# Altium schematic sheet DC Supply Input.SchDoc: Filter Test Board
size A4; SheetNumber: 1; SheetTotal: 1
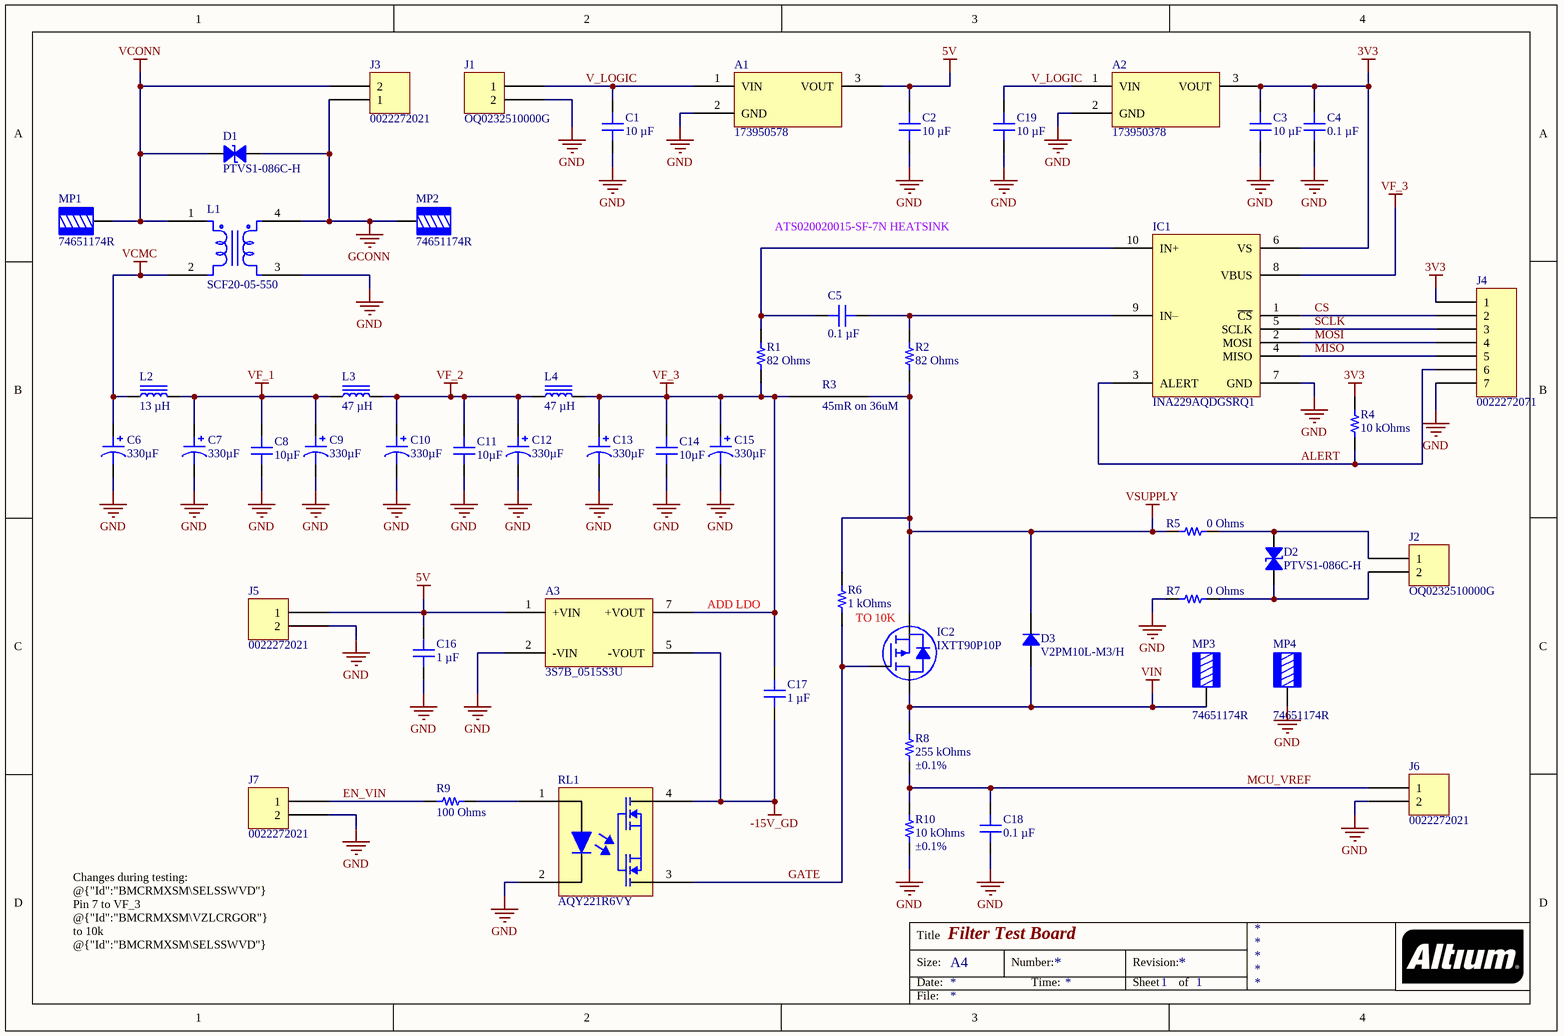
[diagram p0: DC Supply Input.SchDoc]

## Parts
A1  173950578  [WURTH WPME-FDSM SIP-3 173950x78]
A2  173950378  [WURTH WPME-FDSM SIP-3 173950x78]
A3  3S7B_0515S3U  [GAPTEC 3S7B_3U SINGLE]
C1  10 µF  [CAP 1206_3216 - 0.8MM]
C2  10 µF  [CAP 1206_3216 - 0.8MM]
C3  10 µF  [CAP 1206_3216 - 0.8MM]
C4  0.1 µF  [CAP 0603_1608]
C5  0.1 µF  [CAP 0603_1608]
C6  330µF  [CAP TH ALUM ELEC D18.00mm S7.50mm H26.50mm]
C7  330µF  [CAP TH ALUM ELEC D18.00mm S7.50mm H26.50mm]
C8  10µF  [CAP 2220_5650 2.5MM]
C9  330µF  [CAP TH ALUM ELEC D18.00mm S7.50mm H26.50mm]
C10  330µF  [CAP TH ALUM ELEC D18.00mm S7.50mm H26.50mm]
C11  10µF  [CAP 2220_5650 2.5MM]
C12  330µF  [CAP TH ALUM ELEC D18.00mm S7.50mm H26.50mm]
C13  330µF  [CAP TH ALUM ELEC D18.00mm S7.50mm H26.50mm]
C14  10µF  [CAP 2220_5650 2.5MM]
C15  330µF  [CAP TH ALUM ELEC D18.00mm S7.50mm H26.50mm]
C16  1 µF  [CAP 0603_1608]
C17  1 µF  [CAP 0603_1608]
C18  0.1 µF  [CAP 1812_4532 1.1MM]
C19  10 µF  [CAP 1206_3216 - 0.8MM]
D1  PTVS1-086C-H  [BOURNS PTSV-xxxC-H]
D2  PTVS1-086C-H  [BOURNS PTSV-xxxC-H]
D3  V2PM10L-M3/H  [VISHAY SMP DO-220AA]
IC1  INA229AQDGSRQ1  [TI VSSOP-10 DGS]
IC2  IXTT90P10P  [IXYS TO-268 P-CH GDS]
J1  OQ0232510000G  [FCI 06-381-2PIN]
J2  OQ0232510000G  [FCI 06-381-2PIN]
J3  0022272021  [MOLEX KK 0022272021]
J4  0022272071  [MOLEX KK 0022272071]
J5  0022272021  [MOLEX KK 0022272021]
J6  0022272021  [MOLEX KK 0022272021]
J7  0022272021  [MOLEX KK 0022272021]
L1  SCF20-05-550  [KEMET SCF20-05-550]
L2  13 µH  [WURTH WE-HCI 1365]
L3  47 µH  [WURTH WE-HCF 14.5MM]
L4  47 µH  [WURTH WE-HCF 14.5MM]
MP1  74651174R  [WURTH 74651174]
MP2  74651174R  [WURTH 74651174]
MP3  74651174R  [WURTH 74651174]
MP4  74651174R  [WURTH 74651174]
R1  82 Ohms  [RES 0603_1608]
R2  82 Ohms  [RES 0603_1608]
R3  45mR on 36uM  [PCB Shunt 0.3mm x 20mm - 45mOhm on 36uM]  (net tie, no BOM)
R4  10 kOhms  [RES 0603_1608]
R5  0 Ohms  [RES 0805_2012]
R6  1 kOhms  [RES 0805_2012]
R7  0 Ohms  [RES 0805_2012]
R8  Tolerance: ±0.1%  [RES 0603_1608]  (hidden comment: 255 kOhms)
R9  100 Ohms  [RES 0603_1608]
R10  Tolerance: ±0.1%  [RES 0603_1608]  (hidden comment: 10 kOhms)
RL1  AQY221R6VY  [PANASONIC CxR10_CxR5]

## Nets
3V3: A2.3(VOUT) C3.2 C4.2 IC1.6(VS) J4.1 R4.1
5V: A1.3(VOUT) A3.1(+VIN) C2.2 C16.2 J5.1
-15V_GD: A3.5(-VOUT) C17.1 RL1.4
GCONN: D1.2 J3.1 L1.4 MP2.1
GND: A1.2(GND) A2.2(GND) A3.2(-VIN) C1.1 C2.1 C3.1 C4.1 C6.2 C7.2 C8.1 C9.2 C10.2 C11.1 C12.2 C13.2 C14.1 C15.2 C16.1 C18.1 C19.1 IC1.7(GND) J1.2 J4.7 J5.2 J6.2 J7.2 L1.3 MP4.1 R7.2 R10.1 RL1.2
VCMC: C6.1 L1.2 L2.2
VCONN: D1.1 J3.2 L1.1 MP1.1
VF_1: C7.1 C8.2 C9.1 L2.1 L3.1
VF_2: C10.1 C11.2 C12.1 L3.2 L4.1
VF_3: A3.7(+VOUT) C13.1 C14.2 C15.1 C17.2 IC1.8(VBUS) L4.2 R1.1 R3.2
VIN: D3.2 IC2.D MP3.1 R8.1
VSUPPLY: D3.1 IC2.S R2.1 R3.1 R5.2 R6.2
ALERT: IC1.3(ALERT) J4.6 R4.2
CS: IC1.1(~{CS}) J4.2
EN_VIN: J7.1 R9.1
GATE: IC2.G R6.1 RL1.3
MCU_VREF: C18.2 J6.1 R8.2 R10.2
MISO: IC1.4(MISO) J4.5
MOSI: IC1.2(MOSI) J4.4
SCLK: IC1.5(SCLK) J4.3
V_LOGIC: A1.1(VIN) A2.1(VIN) C1.2 C19.2 J1.1
NetC5_1: C5.1 IC1.9(IN–) R2.2
NetC5_2: C5.2 IC1.10(IN+) R1.2
NetD2_1: D2.1 J2.1 R5.1
NetD2_2: D2.2 J2.2 R7.1
NetR9_2: R9.2 RL1.1

## Notes on the sheet
- ATS020020015-SF-7N HEATSINK
- ADD LDO
- TO 10K
- Changes during testing:
  @{"Id":"BMCRMXSM\SELSSWVD"} Pin 7 to VF_3
  @{"Id":"BMCRMXSM\VZLCRGOR"} to 10k
  @{"Id":"BMCRMXSM\SELSSWVD"} needs LDO between it and relay
- Title
- Size:
- Date:
- A4
- Number:
- Time:
- Revision:
- Sheet
- of
- File:

## Library data of the parts
A1 = 173950578: DC DC CONVERTER 5V 2.5W; Manufacturer: Würth Elektronik; Current - Output (Max): 500mA; Efficiency: 95%; Number of Outputs: 1; Voltage - Input (Max): 28V; Voltage - Input (Min): 6V; Part Number: 173950578; Applications: ITE (Commercial); ComponentLink1Description: Datasheet; ComponentLink1URL: //media.digikey.com/pdf/Data%20Sheets/Wurth%20Electronics%20PDFs/173950378_173950578.pdf; ComponentLink2Description: DigiKey Link; ComponentLink2URL: https://www.digikey.com/en/products/detail/würth-elektronik/173950578/5725367; Features: OTP, OVP, SCP; LastUpdated: 10/08/2022 09:48:51; Lifecycle Status: Active; Minimum Order: 1; Mounting Type: Through Hole; Operating Temperature: -40°C ~ 85°C; Package / Case: 3-SIP Module; Packaging: Tube; PartId: 51; Part Status: Active; Power (Watts): 2.5 W; Price: 4.40; Series: MagI³C (1W); Size / Dimension: 0.46" L x 0.33" W x 0.41" H (11.6mm x 8.5mm x 10.4mm); Supplier 1: DigiKey; Supplier Part Number 1: 732-8243-5-ND; Type: Linear Regulator Replacement; Voltage - Output 1: 5V
A2 = 173950378: DC DC CONVERTER 3.3V 1.65W; Manufacturer: Würth Elektronik; Current - Output (Max): 500mA; Efficiency: 95%; Number of Outputs: 1; Voltage - Input (Max): 28V; Voltage - Input (Min): 6V; Part Number: 173950378; Applications: ITE (Commercial); ComponentLink1Description: Datasheet; ComponentLink1URL: //media.digikey.com/pdf/Data%20Sheets/Wurth%20Electronics%20PDFs/173950378_173950578.pdf; ComponentLink2Description: DigiKey Link; ComponentLink2URL: https://www.digikey.com/en/products/detail/würth-elektronik/173950378/5725366; Features: OTP, OVP, SCP; LastUpdated: 10/08/2022 09:47:10; Lifecycle Status: Active; Minimum Order: 1; Mounting Type: Through Hole; Operating Temperature: -40°C ~ 85°C; Package / Case: 3-SIP Module; Packaging: Tube; PartId: 50; Part Status: Active; Power (Watts): 1.65 W; Price: 4.40; Series: MagI³C (1W); Size / Dimension: 0.46" L x 0.33" W x 0.41" H (11.6mm x 8.5mm x 10.4mm); Supplier 1: DigiKey; Supplier Part Number 1: 732-8242-5-ND; Type: Linear Regulator Replacement; Voltage - Output 1: 3.3V
A3 = 3S7B_0515S3U: DC-DC; Manufacturer: GAPTEC Electronic; Current - Output (Max): 200mA; Efficiency: 84%; Number of Outputs: 1; Power (Watts): 3 W; Voltage - Input (Max): 5.5V; Voltage - Input (Min): 4.5V; Voltage - Isolation: 3 kV; Voltage - Output 1: 15V; Part Number: 3S7B_0515S3U; Applications: ITE (Commercial); ComponentLink1Description: Datasheet; ComponentLink1URL: https://gaptec-electronic.com/datenblaetter/3S7B_3U.pdf; ComponentLink2Description: DigiKey Link; ComponentLink2URL: https://www.digikey.com/en/products/detail/gaptec-electronic/3S7B-0515S3U/13692172; LastUpdated: 20/08/2023 04:04:06; Lifecycle Status: Active; Minimum Order: 1; Mounting Type: Through Hole; Operating Temperature: -40°C ~ 85°C; Packaging: Tube; PartId: 69; Part Status: Active; Price: 5.05; Series: 3S7B_3U (3W); Size / Dimension: 0.77" L x 0.28" W x 0.39" H (19.6mm x 7.0mm x 10.0mm); Supplier 1: DigiKey; Supplier Part Number 1: 3182-3S7B_0515S3U-ND; Type: Isolated Module
C1-C3 C19 = CL31B106KAHNNNE: CAP CER 10UF 25V X7R 1206; manufacturer: Samsung Electro-Mechanics; Tolerance: ±10%; Part Number: CL31B106KAHNNNE; Value: 10 µF; Applications: General Purpose; Capacitance: 10 µF; componentlink1description: Datasheet; componentlink1url: http://www.samsungsem.com/kr/support/product-search/mlcc/CL31B106KAHNNNE.jsp; componentlink2description: DigiKey Link; componentlink2url: https://www.digikey.com/en/products/detail/samsung-electro-mechanics/CL31B106KAHNNNE/3887462; Device Package: 1206 (3216 Metric); lastupdated: 12/09/2023 19:14:51; Lifecycle Status: Active; Minimum Order: 1; Mounting Type: Surface Mount, MLCC; Operating Temperature: -55°C ~ 125°C; Package / Case: 1206 (3216 Metric); packaging: TapeAndReel; partid: 40754; Part Status: Active; price: 0.03; series: CL; Size / Dimension: 0.126" L x 0.063" W (3.20mm x 1.60mm); Supplier 1: DigiKey; Supplier Part Number 1: 1276-1804-1-ND; Temperature Coefficient: X7R; Thickness (Max): 0.071" (1.80mm); Voltage - Rated: 25V
C4 C5 = CL10B104KB8NNNC: CAP CER 0.1UF 50V X7R 0603; manufacturer: Samsung Electro-Mechanics; Tolerance: ±10%; Part Number: CL10B104KB8NNNC; Value: 0.1 µF; Applications: General Purpose; Capacitance: 0.1 µF; componentlink1description: Datasheet; componentlink1url: http://www.samsungsem.com/kr/support/product-search/mlcc/CL10B104KB8NNNC.jsp; componentlink2description: DigiKey Link; componentlink2url: https://www.digikey.com/en/products/detail/samsung-electro-mechanics/CL10B104KB8NNNC/3886658; Device Package: 0603 (1608 Metric); lastupdated: 20/08/2023 19:09:00; Lifecycle Status: Active; Minimum Order: 1; Mounting Type: Surface Mount, MLCC; Operating Temperature: -55°C ~ 125°C; Package / Case: 0603 (1608 Metric); packaging: TapeAndReel; partid: 9788; Part Status: Active; price: 0.01; series: CL; Size / Dimension: 0.063" L x 0.031" W (1.60mm x 0.80mm); Supplier 1: DigiKey; Supplier Part Number 1: 1276-1000-1-ND; Temperature Coefficient: X7R; Thickness (Max): 0.035" (0.90mm); Voltage - Rated: 50V
C6 C7 C9 C10 C12 C13 C15 = UCY2C331MHD6TN: CAP ALUM 330UF 20% 160V RADIAL; manufacturer: Nichicon; Lifetime @ Temp.: 12000 Hrs @ 105°C; Polarization: Polar; Ripple Current @ High Frequency: 2.89A @ 100kHz; Ripple Current @ Low Frequency: 1.445A @ 120Hz; Part Number: UCY2C331MHD6TN; Applications: General Purpose; Capacitance: 330µF; componentlink1description: Datasheet; componentlink1url: http://nichicon-us.com/english/products/pdfs/e-ucy.pdf; componentlink2description: DigiKey Link; componentlink2url: http://digikey.com/product-detail/en/nichicon/UCY2C331MHD6TN/493-4791-1-ND/3129128; Device Package: Radial, Can; Height - Seated (Max): 1.043" (26.50mm); lastupdated: 02/09/2020 01:33:18; Lead Spacing: 0.295" (7.50mm); Lifecycle Status: Active; Minimum Order: 1; Mounting Type: Through Hole; Operating Temperature: -40°C ~ 105°C; Package / Case: Radial, Can; packaging: TapeAndBox; partid: 18242; Part Status: Active; price: 1.37; series: UCY; Size / Dimension: 0.709" Dia (18.00mm); Supplier 1: DigiKey; Supplier Part Number 1: 493-4791-1-ND; Tolerance: ±20%; value: 330µF; Voltage - Rated: 160V
C8 C11 C14 = CGA9N3X7S2A106M230KB: CAP CER 10UF 100V X7S 2220; manufacturer: TDK Corporation; Tolerance: ±20%; Part Number: CGA9N3X7S2A106M230KB; Value: 10µF; Applications: Automotive; Capacitance: 10µF; componentlink1description: Datasheet; componentlink1url: https://product.tdk.com/info/en/catalog/datasheets/mlcc_automotive_midvoltage_en.pdf?ref_disty=digikey; componentlink2description: DigiKey Link; componentlink2url: http://digikey.com/product-detail/en/tdk-corporation/CGA9N3X7S2A106M230KB/445-13152-1-ND/3954818; Device Package: 2220 (5750 Metric); lastupdated: 02/09/2020 01:11:20; Lifecycle Status: Active; Minimum Order: 1; Mounting Type: Surface Mount, MLCC; Operating Temperature: -55°C ~ 125°C; Package / Case: 2220 (5750 Metric); packaging: TapeAndReel; Part Status: Active; price: 1.11; Ratings: AEC-Q200; series: CGA; Size / Dimension: 0.224" L x 0.197" W (5.70mm x 5.00mm); Supplier 1: DigiKey; Supplier Part Number 1: 445-13152-1-ND; Temperature Coefficient: X7S; Thickness (Max): 0.098" (2.50mm); Voltage - Rated: 100V
C16 C17 = GCM188R71E105KA64D: CAP CER 1UF 25V X7R 0603; manufacturer: Murata Electronics; Tolerance: ±10%; Part Number: GCM188R71E105KA64D; Value: 1 µF; Applications: Automotive; Capacitance: 1 µF; componentlink1description: Datasheet; componentlink1url: https://www.murata.com/~/media/webrenewal/support/library/catalog/products/capacitor/mlcc/c03e.ashx?la=en-us; componentlink2description: DigiKey Link; componentlink2url: https://www.digikey.com/en/products/detail/murata-electronics/GCM188R71E105KA64D/4903956; Device Package: 0603 (1608 Metric); lastupdated: 20/08/2023 19:09:04; Lifecycle Status: Active; Minimum Order: 1; Mounting Type: Surface Mount, MLCC; Operating Temperature: -55°C ~ 125°C; Package / Case: 0603 (1608 Metric); packaging: TapeAndReel; partid: 6762; Part Status: Active; price: 0.03; Ratings: AEC-Q200; series: GCM; Size / Dimension: 0.063" L x 0.031" W (1.60mm x 0.80mm); Supplier 1: DigiKey; Supplier Part Number 1: 490-10673-1-ND; Temperature Coefficient: X7R; Thickness (Max): 0.035" (0.90mm); Voltage - Rated: 25V
C18 = C1812C104J2GACAUTO: CAP CER 0.1UF 200V C0G/NP0 1812; manufacturer: KEMET; Temperature Coefficient: C0G, NP0; Tolerance: ±5%; Part Number: C1812C104J2GACAUTO; Value: 0.1 µF; Applications: Automotive; Capacitance: 0.1 µF; componentlink1description: Datasheet; componentlink1url: https://api.kemet.com/component-edge/download/datasheet/C1812C104J2GACAUTO.pdf; componentlink2description: DigiKey Link; componentlink2url: https://www.digikey.com/en/products/detail/kemet/C1812C104J2GACAUTO/4860166; Device Package: 1812 (4532 Metric); Features: Low ESL; lastupdated: 16/08/2023 19:37:06; Lifecycle Status: Active; Minimum Order: 1; Mounting Type: Surface Mount, MLCC; Operating Temperature: -55°C ~ 125°C; Package / Case: 1812 (4532 Metric); packaging: TapeAndReel; Part Status: Active; price: 0.57; Ratings: AEC-Q200; series: SMD Auto C0G; Size / Dimension: 0.177" L x 0.126" W (4.50mm x 3.20mm); Supplier 1: DigiKey; Supplier Part Number 1: 399-11585-1-ND; Thickness (Max): 0.087" (2.20mm); Voltage - Rated: 200V
D1 D2 = PTVS1-086C-H: TVS DIODE 86VWM 99VC 2DFN; Manufacturer: Bourns Inc.; Bidirectional Channels: 1; Current - Peak Pulse (10/1000µs): 1000A (1kA) (8/20µs); Power Line Protection: No; Type: Zener; Voltage - Breakdown (Min): 96V; Voltage - Clamping (Max) @ Ipp: 99V (Typ); Voltage - Reverse Standoff (Typ): 86V; Part Number: PTVS1-086C-H; Applications: General Purpose; ComponentLink1Description: Datasheet; ComponentLink1URL: https://www.digikey.com http://www.bourns.com/docs/Product-Datasheets/PTVS1-xxxC-H.pdf; ComponentLink2Description: DigiKey Link; ComponentLink2URL: https://www.digikey.com/en/products/detail/bourns-inc/PTVS1-086C-H/16642576; LastUpdated: 20/08/2023 21:00:35; Lifecycle Status: Active; Minimum Order: 1; Mounting Type: Surface Mount; Operating Temperature: -55°C ~ 125°C (TA); Packaging: TapeAndReel; PartId: 11756; Part Status: Active; Price: 2.82; Series: PTVS; Supplier 1: DigiKey; Supplier Part Number 1: 118-PTVS1-086C-HCT-ND; Supplier Device Package: 2-DFN (8x6)
D3 = V2PM10L-M3/H: DIODE SCHOTTKY 100V 1.9A DO220AA; Manufacturer: Vishay General Semiconductor - Diodes Division; Capacitance @ Vr, F: 195pF @ 4V, 1MHz; Current - Reverse Leakage @ Vr: 100 µA @ 100 V; Speed: Fast Recovery =< 500ns, > 200mA (Io); Voltage - Forward (Vf) (Max) @ If: 550 mV @ 1 A; Part Number: V2PM10L-M3/H; ComponentLink1Description: Datasheet; ComponentLink1URL: https://www.vishay.com/docs/87463/v2pm10l.pdf; ComponentLink2Description: DigiKey Link; ComponentLink2URL: https://www.digikey.com/en/products/detail/vishay-general-semiconductor-diodes-division/V2PM10L-M3-H/10638928; Current - Average Rectified (Io): 1.9A; Diode Type: Schottky; LastUpdated: 19/08/2023 20:45:06; Lifecycle Status: Active; Minimum Order: 1; Mounting Type: Surface Mount; Operating Temperature - Junction: -40°C ~ 175°C; Packaging: TapeAndReel; PartId: 3477; Part Status: Active; Price: 0.06; Series: eSMP®, TMBS®; Supplier 1: DigiKey; Supplier Part Number 1: 112-V2PM10L-M3/HCT-ND; Supplier Device Package: DO-220AA (SMP); Voltage - DC Reverse (Vr) (Max): 100 V
IC1 = INA229AQDGSRQ1: IC OPAMP GP 1 CIRCUIT 10VSSOP; Manufacturer: Texas Instruments; Amplifier Type: General Purpose; Current - Input Bias: 100 pA; Current - Supply: 640µA; Number of Circuits: 1; Output Type: Open Drain; Voltage - Input Offset: 0.3 µV; Part Number: INA229AQDGSRQ1; ComponentLink2Description: DigiKey Link; ComponentLink2URL: https://www.digikey.com/en/products/detail/texas-instruments/INA229AQDGSRQ1/14641455; LastUpdated: 20/08/2023 19:45:13; Lifecycle Status: Active; Minimum Order: 1; Mounting Type: Surface Mount; Operating Temperature: -40°C ~ 125°C (TA); Packaging: TapeAndReel; PartId: 53; Part Status: Active; Price: 3.66; Series: Automotive, AEC-Q100; Supplier 1: DigiKey; Supplier Part Number 1: 296-INA229AQDGSRQ1CT-ND; Supplier Device Package: 10-VSSOP
IC2 = IXTT90P10P: MOSFET P-CH 100V 90A TO268; Manufacturer: IXYS; Current - Continuous Drain (Id) @ 25°C: 90A (Tc); Drive Voltage (Max Rds On,  Min Rds On): 10V; FET Type: P-Channel; Gate Charge (Qg) (Max) @ Vgs: 120 nC @ 10 V; Input Capacitance (Ciss) (Max) @ Vds: 5800 pF @ 25 V; Power Dissipation (Max): 462W (Tc); Rds On (Max) @ Id, Vgs: 25mOhm @ 45A, 10V; Vgs (Max): ±20V; Vgs(th) (Max) @ Id: 4V @ 250µA; Part Number: IXTT90P10P; ComponentLink1Description: Datasheet; ComponentLink1URL: http://ixapps.ixys.com/DataSheet/DS99986B(IXTH-T90P10P).pdf; ComponentLink2Description: DigiKey Link; ComponentLink2URL: https://www.digikey.com/en/products/detail/ixys/IXTT90P10P/1995431; Drain to Source Voltage (Vdss): 100 V; LastUpdated: 17/08/2023 02:38:22; Lifecycle Status: Active; Minimum Order: 1; Mounting Type: Surface Mount; Operating Temperature: -55°C ~ 150°C (TJ); Package / Case: TO-268-3, D³Pak (2 Leads + Tab), TO-268AA; Packaging: Tube; Part Status: Active; Price: 8.00; Series: PolarP™; Supplier 1: DigiKey; Supplier Part Number 1: IXTT90P10P-ND; Supplier Device Package: TO-268AA; Technology: MOSFET (Metal Oxide)
J1 J2 = OQ0232510000G: TERM BLOCK HDR 2POS 90DEG 3.81MM; Manufacturer: Amphenol Anytek; Current - UL: 10A; Header Orientation: 90°, Right Angle; Number of Levels: 1; Number of Positions: 2; Pitch: 0.150" (3.81mm); Voltage - UL: 300V; Part Number: OQ0232510000G; Color: Green; ComponentLink1Description: Datasheet; ComponentLink1URL: http://portal.fciconnect.com/Comergent//fci/drawing/oqxx32x100j0g.pdf; ComponentLink2Description: DigiKey Link; ComponentLink2URL: //digikey.com/product-detail/en/amphenol-anytek/OQ0232510000G/609-3819-ND/2261255; Contact Mating Finish: Tin; LastUpdated: 16/12/2019 19:14:30; Lifecycle Status: 0; Minimum Order: 1; Mounting Type: Through Hole; Operating Temperature: -40°C ~ 115°C; Packaging: Bulk; Part Status: Active; Positions Per Level: 2; Price: 0.49; Series: 06-381; Supplier 1: DigiKey; Supplier Part Number 1: 609-3819-ND; Termination Style: Solder; Type: Header, Male Pins, Shrouded (4 Side)
J3 J5-J7 = 0022272021: CONN HEADER VERT 2POS 2.54MM; Manufacturer: Molex; Contact Length - Mating: 0.295" (7.49mm); Contact Length - Post: 0.140" (3.56mm); Material Flammability Rating: UL94 V-0; Number of Positions: 2; Number of Positions Loaded: All; Overall Contact Length: 0.560" (14.22mm); Pitch - Mating: 0.100" (2.54mm); Shrouding: Shrouded - 1 Wall; Style: Board to Cable/Wire; Part Number: 0022272021; ComponentLink1Description: Datasheet; ComponentLink1URL: https://www.molex.com/pdm_docs/sd/022272021_sd.pdf; ComponentLink2Description: DigiKey Link; ComponentLink2URL: http://digikey.com/product-detail/en/molex/0022272021/WM4111-ND/1130577; Connector Type: Header; Contact Finish - Mating: Tin; Contact Finish - Post: Tin; Contact Finish Thickness - Mating: 100.0µin (2.54µm); Contact Material: Brass; Contact Shape: Square; Contact Type: Male Pin; Fastening Type: Friction Lock; Insulation Color: Natural; Insulation Height: 0.461" (11.70mm); Insulation Material: Polyamide (PA), Nylon; LastUpdated: 12/01/2020 23:51:43; Lifecycle Status: Active; Minimum Order: 1; Mounting Type: Through Hole; Number of Rows: 1; Packaging: Bulk; PartId: 76; Part Status: Active; Price: 0.27; Series: KK 6410; Supplier 1: DigiKey; Supplier Part Number 1: WM4111-ND; Termination: Solder
J4 = 0022272071: CONN HEADER VERT 7POS 2.54MM; Manufacturer: Molex; Contact Length - Mating: 0.295" (7.49mm); Contact Length - Post: 0.140" (3.56mm); Material Flammability Rating: UL94 V-0; Number of Positions: 7; Number of Positions Loaded: All; Overall Contact Length: 0.560" (14.22mm); Pitch - Mating: 0.100" (2.54mm); Shrouding: Shrouded - 1 Wall; Style: Board to Cable/Wire; Part Number: 0022272071; ComponentLink1Description: Datasheet; ComponentLink1URL: https://www.molex.com/pdm_docs/sd/022272071_sd.pdf; ComponentLink2Description: DigiKey Link; ComponentLink2URL: http://digikey.com/product-detail/en/molex/0022272071/WM4116-ND/1130582; Connector Type: Header; Contact Finish - Mating: Tin; Contact Finish - Post: Tin; Contact Finish Thickness - Mating: 100.0µin (2.54µm); Contact Material: Brass; Contact Shape: Square; Contact Type: Male Pin; Fastening Type: Friction Lock; Insulation Color: Natural; Insulation Height: 0.461" (11.70mm); Insulation Material: Polyamide (PA), Nylon; LastUpdated: 12/01/2020 23:52:32; Lifecycle Status: Active; Minimum Order: 1; Mounting Type: Through Hole; Number of Rows: 1; Packaging: Bulk; PartId: 81; Part Status: Active; Price: 0.56; Series: KK 6410; Supplier 1: DigiKey; Supplier Part Number 1: WM4116-ND; Termination: Solder
L1 = SCF20-05-550: CMC 5.5MH 5A 2LN TH; Manufacturer: KEMET; DC Resistance (DCR) (Max): 28mOhm; Filter Type: Power Line; Inductance @ Frequency: 5.5mH @ 10kHz; Number of Lines: 2; Voltage Rating - AC: 250V; Part Number: SCF20-05-550; ComponentLink1Description: Datasheet; ComponentLink1URL: https://api.kemet.com/component-edge/download/datasheet/SCF20-05-550.pdf; ComponentLink2Description: DigiKey Link; ComponentLink2URL: http://digikey.com/product-detail/en/kemet/SCF20-05-550/399-10780-ND/4290846; Current Rating (Max): 5A; Height (Max): 0.984" (25.00mm); LastUpdated: 19/08/2023 04:18:52; Lifecycle Status: Active; Minimum Order: 1; Mounting Type: Through Hole; Operating Temperature: -25°C ~ 120°C; Package / Case: Vertical, No Base, 4 PC Pin; Packaging: Bulk; Part Status: Active; Price: 7.23; Series: SC; Size / Dimension: 0.984" L x 0.610" W (25.00mm x 15.50mm); Supplier 1: DigiKey; Supplier Part Number 1: 399-10780-ND; Voltage Rating - DC: 250V
L2 = 7443551131: FIXED IND 13UH 10A 11.2 MOHM SMD; Manufacturer: Würth Elektronik; Current - Saturation: 9A; Frequency - Self Resonant: 14MHz; Inductance Frequency - Test: 100 kHz; Material - Core: Nonstandard; Shielding: Shielded; Tolerance: ±20%; Type: Wirewound; Part Number: 7443551131; ComponentLink1Description: Datasheet; ComponentLink1URL: https://katalog.we-online.de/pbs/datasheet/7443551131.pdf; ComponentLink2Description: DigiKey Link; ComponentLink2URL: https://www.digikey.com/en/products/detail/würth-elektronik/7443551131/1638545; Current Rating (Amps): 10 A; DC Resistance (DCR): 11.2mOhm; Device Package: Nonstandard; Height - Seated (Max): 0.256" (6.50mm); Inductance: 13 µH; LastUpdated: 18/08/2023 20:44:44; Lifecycle Status: Active; Minimum Order: 1; Mounting Type: Surface Mount; Operating Temperature: -40°C ~ 155°C; Package / Case: Nonstandard; Packaging: TapeAndReel; PartId: 5628; Part Status: Active; Price: 2.50; Ratings: AEC-Q200; Series: WE-HCI; Size / Dimension: 0.512" L x 0.504" W (13.00mm x 12.80mm); Supplier 1: DigiKey; Supplier Part Number 1: 732-1140-1-ND; Supplier Device Package: 1365; Value: 13 µH
L3 L4 = 7443634700: FIXED IND 47UH 12A 12.2 MOHM SMD; Manufacturer: Würth Elektronik; Current - Saturation: 8.5A; Frequency - Self Resonant: 10MHz; Inductance Frequency - Test: 100 kHz; Material - Core: Manganese Zinc Ferrite (MnZn); Shielding: Shielded; Tolerance: ±15%; Type: Drum Core, Wirewound; Part Number: 7443634700; ComponentLink1Description: Datasheet; ComponentLink1URL: https://katalog.we-online.de/pbs/datasheet/7443634700.pdf; ComponentLink2Description: DigiKey Link; ComponentLink2URL: https://www.digikey.com/en/products/detail/würth-elektronik/7443634700/2440342; Current Rating (Amps): 12 A; DC Resistance (DCR): 12.2mOhm; Device Package: Nonstandard; Height - Seated (Max): 0.571" (14.50mm); Inductance: 47 µH; LastUpdated: 18/08/2023 20:35:26; Lifecycle Status: Active; Minimum Order: 1; Mounting Type: Surface Mount; Operating Temperature: -40°C ~ 125°C; Package / Case: Nonstandard; Packaging: TapeAndReel; PartId: 3230; Part Status: Active; Price: 4.84; Ratings: AEC-Q200; Series: WE-HCF; Size / Dimension: 0.858" L x 0.846" W (21.80mm x 21.50mm); Supplier 1: DigiKey; Supplier Part Number 1: 732-2525-1-ND; Value: 47 µH
MP1-MP4 = 74651174R: TERM REDCUBE 4PIN PCB; Manufacturer: Würth Elektronik; Current Rating (Amps): 50 A; Part Number: 74651174R; ComponentLink1Description: Datasheet; ComponentLink1URL: https://katalog.we-online.de/em/datasheet/74651174R.pdf; ComponentLink2Description: DigiKey Link; ComponentLink2URL: https://www.digikey.com/en/products/detail/würth-elektronik/74651174R/6644001; LastUpdated: 07/08/2022 21:19:28; Lifecycle Status: Active; Minimum Order: 1; Mounting Type: Through Hole; Number of Pins: 4; Packaging: TapeAndReel; Part Status: Active; Price: 2.06; Series: REDCUBE WP-THRSH; Supplier 1: DigiKey; Supplier Part Number 1: 732-10905-1-ND; Terminal Type: Shank Terminal; Termination: Solder
R1 R2 = RC0603FR-0782RL: RES 82 OHM 1% 1/10W 0603; Manufacturer: Yageo; Power (Watts): 0.1W, 1/10W; Temperature Coefficient: ±100ppm/°C; Part Number: RC0603FR-0782RL; Value: 82 Ohms; ComponentLink1Description: Datasheet; ComponentLink1URL: https://www.yageo.com/upload/media/product/productsearch/datasheet/rchip/PYu-RC_Group_51_RoHS_L_10.pdf; ComponentLink2Description: DigiKey Link; ComponentLink2URL: https://www.digikey.com/en/products/detail/yageo/RC0603FR-0782RL/727399; Composition: Thick Film; Device Package: 0603 (1608 Metric); Features: Moisture Resistant; Height - Seated (Max): 0.022" (0.55mm); LastUpdated: 20/08/2023 19:34:58; Lifecycle Status: Active; Minimum Order: 1; Number of Terminations: 2; Operating Temperature: -55°C ~ 155°C; Package / Case: 0603 (1608 Metric); Packaging: CutTape; PartId: 19108; Part Status: Active; Price: 0.01; Resistance: 82 Ohms; Series: RC_L; Size / Dimension: 0.063" L x 0.031" W (1.60mm x 0.80mm); Supplier 1: DigiKey; Supplier Part Number 1: 311-82.0HRCT-ND; Supplier Device Package: 0603; Tolerance: ±1%
R3 = Current Shunt 45mR on 36uM
R4 R10 = ERJ-PB3B1002V: RES SMD 10K OHM 0.1% 1/5W 0603; Manufacturer: Panasonic Electronic Components; Power (Watts): 0.2W, 1/5W; Temperature Coefficient: ±50ppm/°C; Part Number: ERJ-PB3B1002V; Value: 10 kOhms; ComponentLink1Description: Datasheet; ComponentLink1URL: https://industrial.panasonic.com/cdbs/www-data/pdf/RDM0000/AOA0000C328.pdf; ComponentLink2Description: DigiKey Link; ComponentLink2URL: https://www.digikey.com/en/products/detail/panasonic-electronic-components/ERJ-PB3B1002V/6212869; Composition: Thick Film; Device Package: 0603 (1608 Metric); Features: Automotive AEC-Q200, Pulse Withstanding; Height - Seated (Max): 0.022" (0.55mm); LastUpdated: 16/08/2023 19:34:16; Lifecycle Status: Active; Minimum Order: 1; Number of Terminations: 2; Operating Temperature: -55°C ~ 155°C; Package / Case: 0603 (1608 Metric); Packaging: TapeAndReel; PartId: 18860; Part Status: Active; Price: 0.02; Ratings: AEC-Q200; Resistance: 10 kOhms; Series: ERJ-PB3; Size / Dimension: 0.063" L x 0.031" W (1.60mm x 0.80mm); Supplier 1: DigiKey; Supplier Part Number 1: P20086CT-ND; Supplier Device Package: 0603
  R4: Tolerance: ±0.1%
R5 R7 = RMCF0805ZT0R00: RES 0 OHM JUMPER 1/8W 0805; Manufacturer: Stackpole Electronics Inc; Power (Watts): 0.125W, 1/8W; Part Number: RMCF0805ZT0R00; Value: 0 Ohms; ComponentLink1Description: Datasheet; ComponentLink1URL: https://www.seielect.com/catalog/sei-packaging.pdf; ComponentLink2Description: DigiKey Link; ComponentLink2URL: https://www.digikey.com/en/products/detail/stackpole-electronics-inc/RMCF0805ZT0R00/1756901; Composition: Thick Film; Device Package: 0805 (2012 Metric); Features: Automotive AEC-Q200; Height - Seated (Max): 0.026" (0.65mm); LastUpdated: 19/08/2023 19:52:02; Lifecycle Status: Active; Minimum Order: 1; Number of Terminations: 2; Operating Temperature: -55°C ~ 155°C; Package / Case: 0805 (2012 Metric); Packaging: CutTape; PartId: 46079; Part Status: Active; Price: 0.01; Ratings: AEC-Q200; Resistance: 0 Ohms; Series: RMCF; Size / Dimension: 0.079" L x 0.049" W (2.00mm x 1.25mm); Supplier 1: DigiKey; Supplier Part Number 1: RMCF0805ZT0R00CT-ND; Supplier Device Package: 0805; Tolerance: Jumper
R6 = ERJ-6ENF1001V: RES SMD 1K OHM 1% 1/8W 0805; Manufacturer: Panasonic Electronic Components; Power (Watts): 0.125W, 1/8W; Temperature Coefficient: ±100ppm/°C; Part Number: ERJ-6ENF1001V; Value: 1 kOhms; ComponentLink1Description: Datasheet; ComponentLink1URL: https://industrial.panasonic.com/cdbs/www-data/pdf/RDA0000/AOA0000C304.pdf; ComponentLink2Description: DigiKey Link; ComponentLink2URL: https://www.digikey.com/en/products/detail/panasonic-electronic-components/ERJ-6ENF1001V/111281; Composition: Thick Film; Device Package: 0805 (2012 Metric); Features: Automotive AEC-Q200; Height - Seated (Max): 0.028" (0.70mm); LastUpdated: 19/08/2023 19:52:50; Lifecycle Status: Active; Minimum Order: 1; Number of Terminations: 2; Operating Temperature: -55°C ~ 155°C; Package / Case: 0805 (2012 Metric); Packaging: TapeAndReel; PartId: 32251; Part Status: Active; Price: 0.01; Ratings: AEC-Q200; Resistance: 1 kOhms; Series: ERJ-6EN; Size / Dimension: 0.079" L x 0.049" W (2.00mm x 1.25mm); Supplier 1: DigiKey; Supplier Part Number 1: P1.00KCCT-ND; Supplier Device Package: 0805; Tolerance: ±1%
R8 = ERA-3AEB2553V: RES SMD 255K OHM 0.1% 1/10W 0603; Manufacturer: Panasonic Electronic Components; Power (Watts): 0.1W, 1/10W; Temperature Coefficient: ±25ppm/°C; Part Number: ERA-3AEB2553V; Value: 255 kOhms; ComponentLink1Description: Datasheet; ComponentLink1URL: https://industrial.panasonic.com/cdbs/www-data/pdf/RDM0000/AOA0000C307.pdf; ComponentLink2Description: DigiKey Link; ComponentLink2URL: https://www.digikey.com/en/products/detail/panasonic-electronic-components/ERA-3AEB2553V/2026963; Composition: Thin Film; Device Package: 0603 (1608 Metric); Features: Automotive AEC-Q200; Height - Seated (Max): 0.022" (0.55mm); LastUpdated: 16/08/2023 19:34:12; Lifecycle Status: Active; Minimum Order: 1; Number of Terminations: 2; Operating Temperature: -55°C ~ 155°C; Package / Case: 0603 (1608 Metric); Packaging: TapeAndReel; PartId: 19922; Part Status: Active; Price: 0.03; Ratings: AEC-Q200; Resistance: 255 kOhms; Series: ERA-3A; Size / Dimension: 0.063" L x 0.031" W (1.60mm x 0.80mm); Supplier 1: DigiKey; Supplier Part Number 1: P255KDBCT-ND; Supplier Device Package: 0603
R9 = RC0603FR-07100RL: RES 100 OHM 1% 1/10W 0603; Manufacturer: Yageo; Power (Watts): 0.1W, 1/10W; Temperature Coefficient: ±100ppm/°C; Part Number: RC0603FR-07100RL; Value: 100 Ohms; ComponentLink1Description: Datasheet; ComponentLink1URL: https://www.yageo.com/upload/media/product/productsearch/datasheet/rchip/PYu-RC_Group_51_RoHS_L_10.pdf; ComponentLink2Description: DigiKey Link; ComponentLink2URL: https://www.digikey.com/en/products/detail/yageo/RC0603FR-07100RL/726888; Composition: Thick Film; Device Package: 0603 (1608 Metric); Features: Moisture Resistant; Height - Seated (Max): 0.022" (0.55mm); LastUpdated: 19/08/2023 19:32:58; Lifecycle Status: Active; Minimum Order: 1; Number of Terminations: 2; Operating Temperature: -55°C ~ 155°C; Package / Case: 0603 (1608 Metric); Packaging: CutTape; PartId: 22598; Part Status: Active; Price: 0.01; Resistance: 100 Ohms; Series: RC_L; Size / Dimension: 0.063" L x 0.031" W (1.60mm x 0.80mm); Supplier 1: DigiKey; Supplier Part Number 1: 311-100HRCT-ND; Supplier Device Package: 0603; Tolerance: ±1%
RL1 = AQY221R6VY: SSR RELAY SPST-NO 1A 0-30V; Manufacturer: Panasonic Electric Works; Circuit: SPST-NO (1 Form A); On-State Resistance (Max): 350 mOhms; Output Type: AC, DC; Voltage - Input: 1.14VDC; Voltage - Load: 0 V ~ 30 V; Part Number: AQY221R6VY; ComponentLink1Description: Datasheet; ComponentLink1URL: http://www3.panasonic.biz/ac/e_download/control/relay/photomos/catalog/semi_eng_rf1a_aqy22_v_cr10.pdf; ComponentLink2Description: DigiKey Link; ComponentLink2URL: https://www.digikey.com/en/products/detail/panasonic-electric-works/AQY221R6VY/3726437; LastUpdated: 20/08/2023 19:05:45; Lifecycle Status: Active; Load Current: 1 A; Minimum Order: 1; Mounting Type: Surface Mount; Package / Case: 4-SMD (0.175", 4.45mm); Packaging: TapeAndReel; Part Status: Active; Price: 5.24; Series: PhotoMOS™ AQY; Supplier 1: DigiKey; Supplier Part Number 1: 255-3592-1-ND; Supplier Device Package: 4-SSOP; Termination Style: SMD (SMT) Tab